# EAGLE schematic Control (EAGLE 7.4.0)
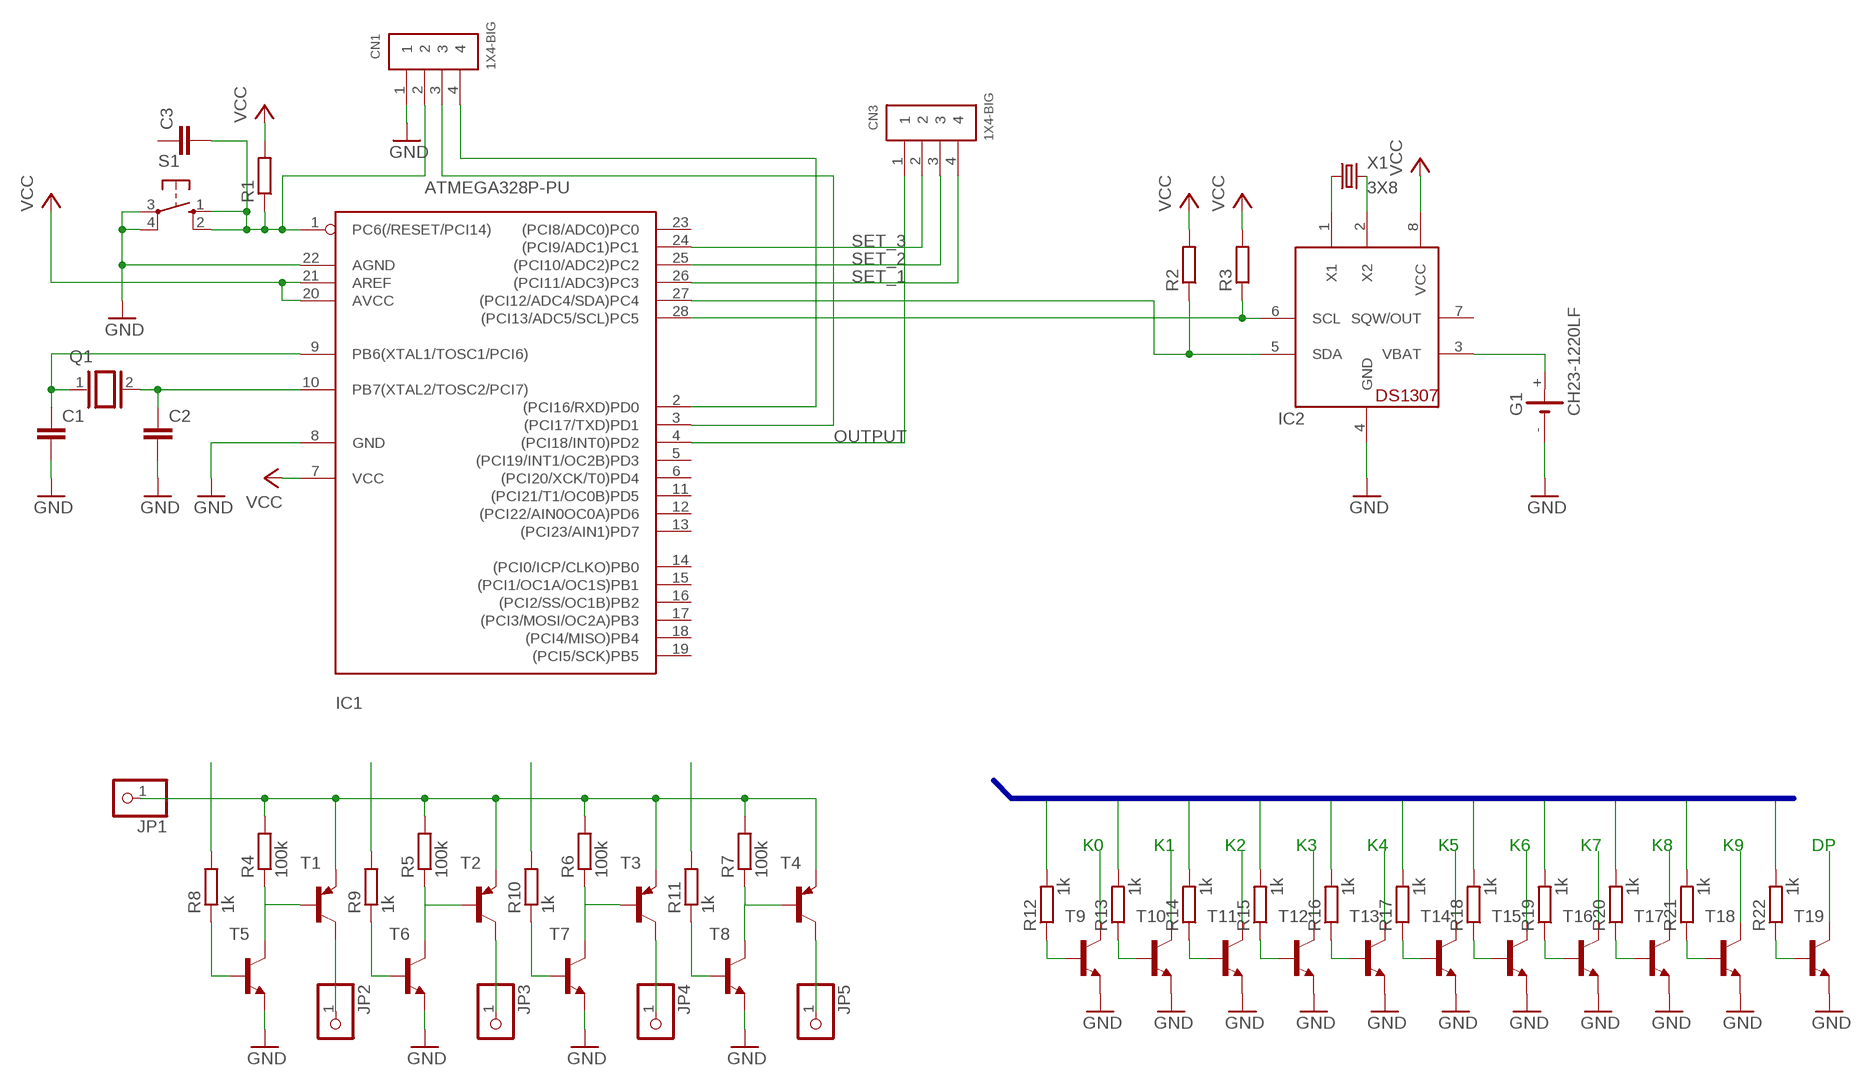
[diagram p0: schematic, sheet 1]

## Parts
C1  C-EU025-024X044  [C025-024X044]
C2  C-EU025-024X044  [C025-024X044]
C3  C-EU050-024X044  [C050-024X044]
CN1  1X4-BIG  [1X04-BIG]
CN3  1X4-BIG  [1X04-BIG]
G1  CH23-1220LF  [CH23-1220LF]
IC1  ATMEGA328P-PU  ATMEGA168-20P  [DIL28-3]
IC2  DS1307  [DIL08]
JP1  PINHD-1X1  [1X01]
JP2  PINHD-1X1  [1X01]
JP3  PINHD-1X1  [1X01]
JP4  PINHD-1X1  [1X01]
JP5  PINHD-1X1  [1X01]
Q1  XTAL/S  [QS]
R1  R-EU_0207/2V  [0207/2V]
R2  R-EU_0204/2V  [0204V]
R3  R-EU_0204/2V  [0204V]
R4  100k  R-EU_0204/2V  [0204V]
R5  100k  R-EU_0204/2V  [0204V]
R6  100k  R-EU_0204/2V  [0204V]
R7  100k  R-EU_0204/2V  [0204V]
R8  1k  R-EU_0204/2V  [0204V]
R9  1k  R-EU_0204/2V  [0204V]
R10  1k  R-EU_0204/2V  [0204V]
R11  1k  R-EU_0204/2V  [0204V]
R12  1k  R-EU_0204/2V  [0204V]
R13  1k  R-EU_0204/2V  [0204V]
R14  1k  R-EU_0204/2V  [0204V]
R15  1k  R-EU_0204/2V  [0204V]
R16  1k  R-EU_0204/2V  [0204V]
R17  1k  R-EU_0204/2V  [0204V]
R18  1k  R-EU_0204/2V  [0204V]
R19  1k  R-EU_0204/2V  [0204V]
R20  1k  R-EU_0204/2V  [0204V]
R21  1k  R-EU_0204/2V  [0204V]
R22  1k  R-EU_0204/2V  [0204V]
S1  10-XX  [B3F-10XX]
T1  MPSA92-PNP-TO92-EBC  [TO92-EBC]
T2  MPSA92-PNP-TO92-EBC  [TO92-EBC]
T3  MPSA92-PNP-TO92-EBC  [TO92-EBC]
T4  MPSA92-PNP-TO92-EBC  [TO92-EBC]
T5  MPSA42-NPN-TO92-EBC  [TO92-EBC]
T6  MPSA42-NPN-TO92-EBC  [TO92-EBC]
T7  MPSA42-NPN-TO92-EBC  [TO92-EBC]
T8  MPSA42-NPN-TO92-EBC  [TO92-EBC]
T9  MPSA42-NPN-TO92-EBC  [TO92-EBC]
T10  MPSA42-NPN-TO92-EBC  [TO92-EBC]
T11  MPSA42-NPN-TO92-EBC  [TO92-EBC]
T12  MPSA42-NPN-TO92-EBC  [TO92-EBC]
T13  MPSA42-NPN-TO92-EBC  [TO92-EBC]
T14  MPSA42-NPN-TO92-EBC  [TO92-EBC]
T15  MPSA42-NPN-TO92-EBC  [TO92-EBC]
T16  MPSA42-NPN-TO92-EBC  [TO92-EBC]
T17  MPSA42-NPN-TO92-EBC  [TO92-EBC]
T18  MPSA42-NPN-TO92-EBC  [TO92-EBC]
T19  MPSA42-NPN-TO92-EBC  [TO92-EBC]
X1  3X8  CRYSTALS-NOGND-WATCH-3X8  [WATCH-3X8]

## Nets
GND: C1.2 C2.2 CN1.1 G1.- IC1.8(GND) IC1.22(AGND) IC2.4(GND) S1.3(P) S1.4(P1) T5.E T6.E T7.E T8.E T9.E T10.E T11.E T12.E T13.E T14.E T15.E T16.E T17.E T18.E T19.E
N$1: C1.1 IC1.9(PB6(XTAL1/TOSC1/PCI6)) Q1.1
N$2: C2.1 IC1.10(PB7(XTAL2/TOSC2/PCI7)) Q1.2
N$3: R4.1 T1.B T5.C
N$4: G1.+ IC2.3(VBAT)
N$5: CN1.4 IC1.2((PCI16/RXD)PD0)
N$6: CN1.3 IC1.3((PCI17/TXD)PD1)
N$7: C3.2 CN1.2 IC1.1(PC6(/RESET/PCI14)) R1.1 S1.1(S) S1.2(S1)
N$8: IC2.1(X1) X1.1
N$9: IC2.2(X2) X1.2
N$10: IC1.28((PCI13/ADC5/SCL)PC5) IC2.6(SCL) R3.1
N$11: IC1.27((PCI12/ADC4/SDA)PC4) IC2.5(SDA) R2.1
N$12: R5.1 T2.B T6.C
N$13: R6.1 T3.B T7.C
N$14: R7.1 T4.B T8.C
N$15: JP2.1 T1.C
N$16: JP3.1 T2.C
N$17: JP4.1 T3.C
N$18: JP5.1 T4.C
N$19: R13.1 T10.B
N$20: JP1.1 R4.2 R5.2 R6.2 R7.2 T1.E T2.E T3.E T4.E
N$21: R8.1 T5.B
N$22: R8.2
N$23: R9.1
N$24: R9.2
N$25: R10.1
N$26: R10.2
N$27: R11.1
N$28: R11.2
N$29: R12.1 T9.B
N$30: R14.1 T11.B
N$31: R15.1 T12.B
N$32: R16.1 T13.B
N$33: R17.1 T14.B
N$34: R18.1 T15.B
N$35: R19.1 T16.B
N$36: R20.1 T17.B
N$37: R21.1 T18.B
N$38: T9.C
N$39: T10.C
N$40: T11.C
N$41: T12.C
N$42: T13.C
N$43: T14.C
N$44: T15.C
N$45: T16.C
N$46: T17.C
N$47: T18.C
N$48: R22.1 T19.B
N$49: T19.C
N$50: R12.2
N$51: R13.2
N$52: R14.2
N$53: R15.2
N$54: R16.2
N$55: R17.2
N$56: R18.2
N$57: R19.2
N$58: R20.2
N$59: R21.2
N$60: R22.2
OUTPUT: CN3.1 IC1.4((PCI18/INT0)PD2)
SET_1: CN3.4 IC1.26((PCI11/ADC3)PC3)
SET_2: CN3.3 IC1.25((PCI10/ADC2)PC2)
SET_3: CN3.2 IC1.24((PCI9/ADC1)PC1)
VCC: IC1.7(VCC) IC1.20(AVCC) IC1.21(AREF) IC2.8(VCC) R1.2 R2.2 R3.2
Unconnected: C3.1 IC1.5((PCI19/INT1/OC2B)PD3) IC1.6((PCI20/XCK/T0)PD4) IC1.11((PCI21/T1/OC0B)PD5) IC1.12((PCI22/AIN0OC0A)PD6) IC1.13((PCI23/AIN1)PD7) IC1.14((PCI0/ICP/CLKO)PB0) IC1.15((PCI1/OC1A/OC1S)PB1) IC1.16((PCI2/SS/OC1B)PB2) IC1.17((PCI3/MOSI/OC2A)PB3) IC1.18((PCI4/MISO)PB4) IC1.19((PCI5/SCK)PB5) IC1.23((PCI8/ADC0)PC0) IC2.7(SQW/OUT) T6.B T7.B T8.B

## Buses
B$1

## Notes on the sheet
- K0 | K1 | K2 | K3 | K4 | K5 | K6 | K7 | K8 | K9 | DP

## Library data of the parts
C1-C3 = rcl:C-EU: CAPACITOR, European symbol
CN1 CN3 = adafruit:1X4: 4-pin connector
G1 = battery:CH23-1220LF: Battary Holder, DIP, 12mm multicomp PART NO. CH-1220LF Source: Data sheet <http://www.farnell.com/datasheets/1505861.pdf>
IC1 = adafruit:ATMEGA168*P: MICROCONTROLLER 16 kBytes FLASH 1 kBytes SRAM 512 Bytes EEPROM USART 8-channel 10 bit ADC
IC2 = adafruit:DS1307: DS1307 Real time clock (RTC) with battery backup ability. Talk to it via i2c
JP1-JP5 = adafruit:PINHD-1X1: Pin header 1x1 for 0.1" spacing With round pins
Q1 = special:XTAL/S: CRYSTAL
R1-R22 = rcl:R-EU_: RESISTOR, European symbol
S1 = switch-omron:10-XX: OMRON SWITCH; MPN: B3F-1000; OC_FARNELL: 176432; OC_NEWARK: 36M3542
T1-T4 = transistor:*-PNP-: PNP Transistror
T5-T19 = transistor:*-NPN-: NPN Transistror BF959 corrected 2008.03.06
X1 = IQD-Frequency-Products:CRYSTALS-NOGND: CRYSTALS CAN NOT GROUNDED